# EAGLE schematic main_board (EAGLE 5.01)
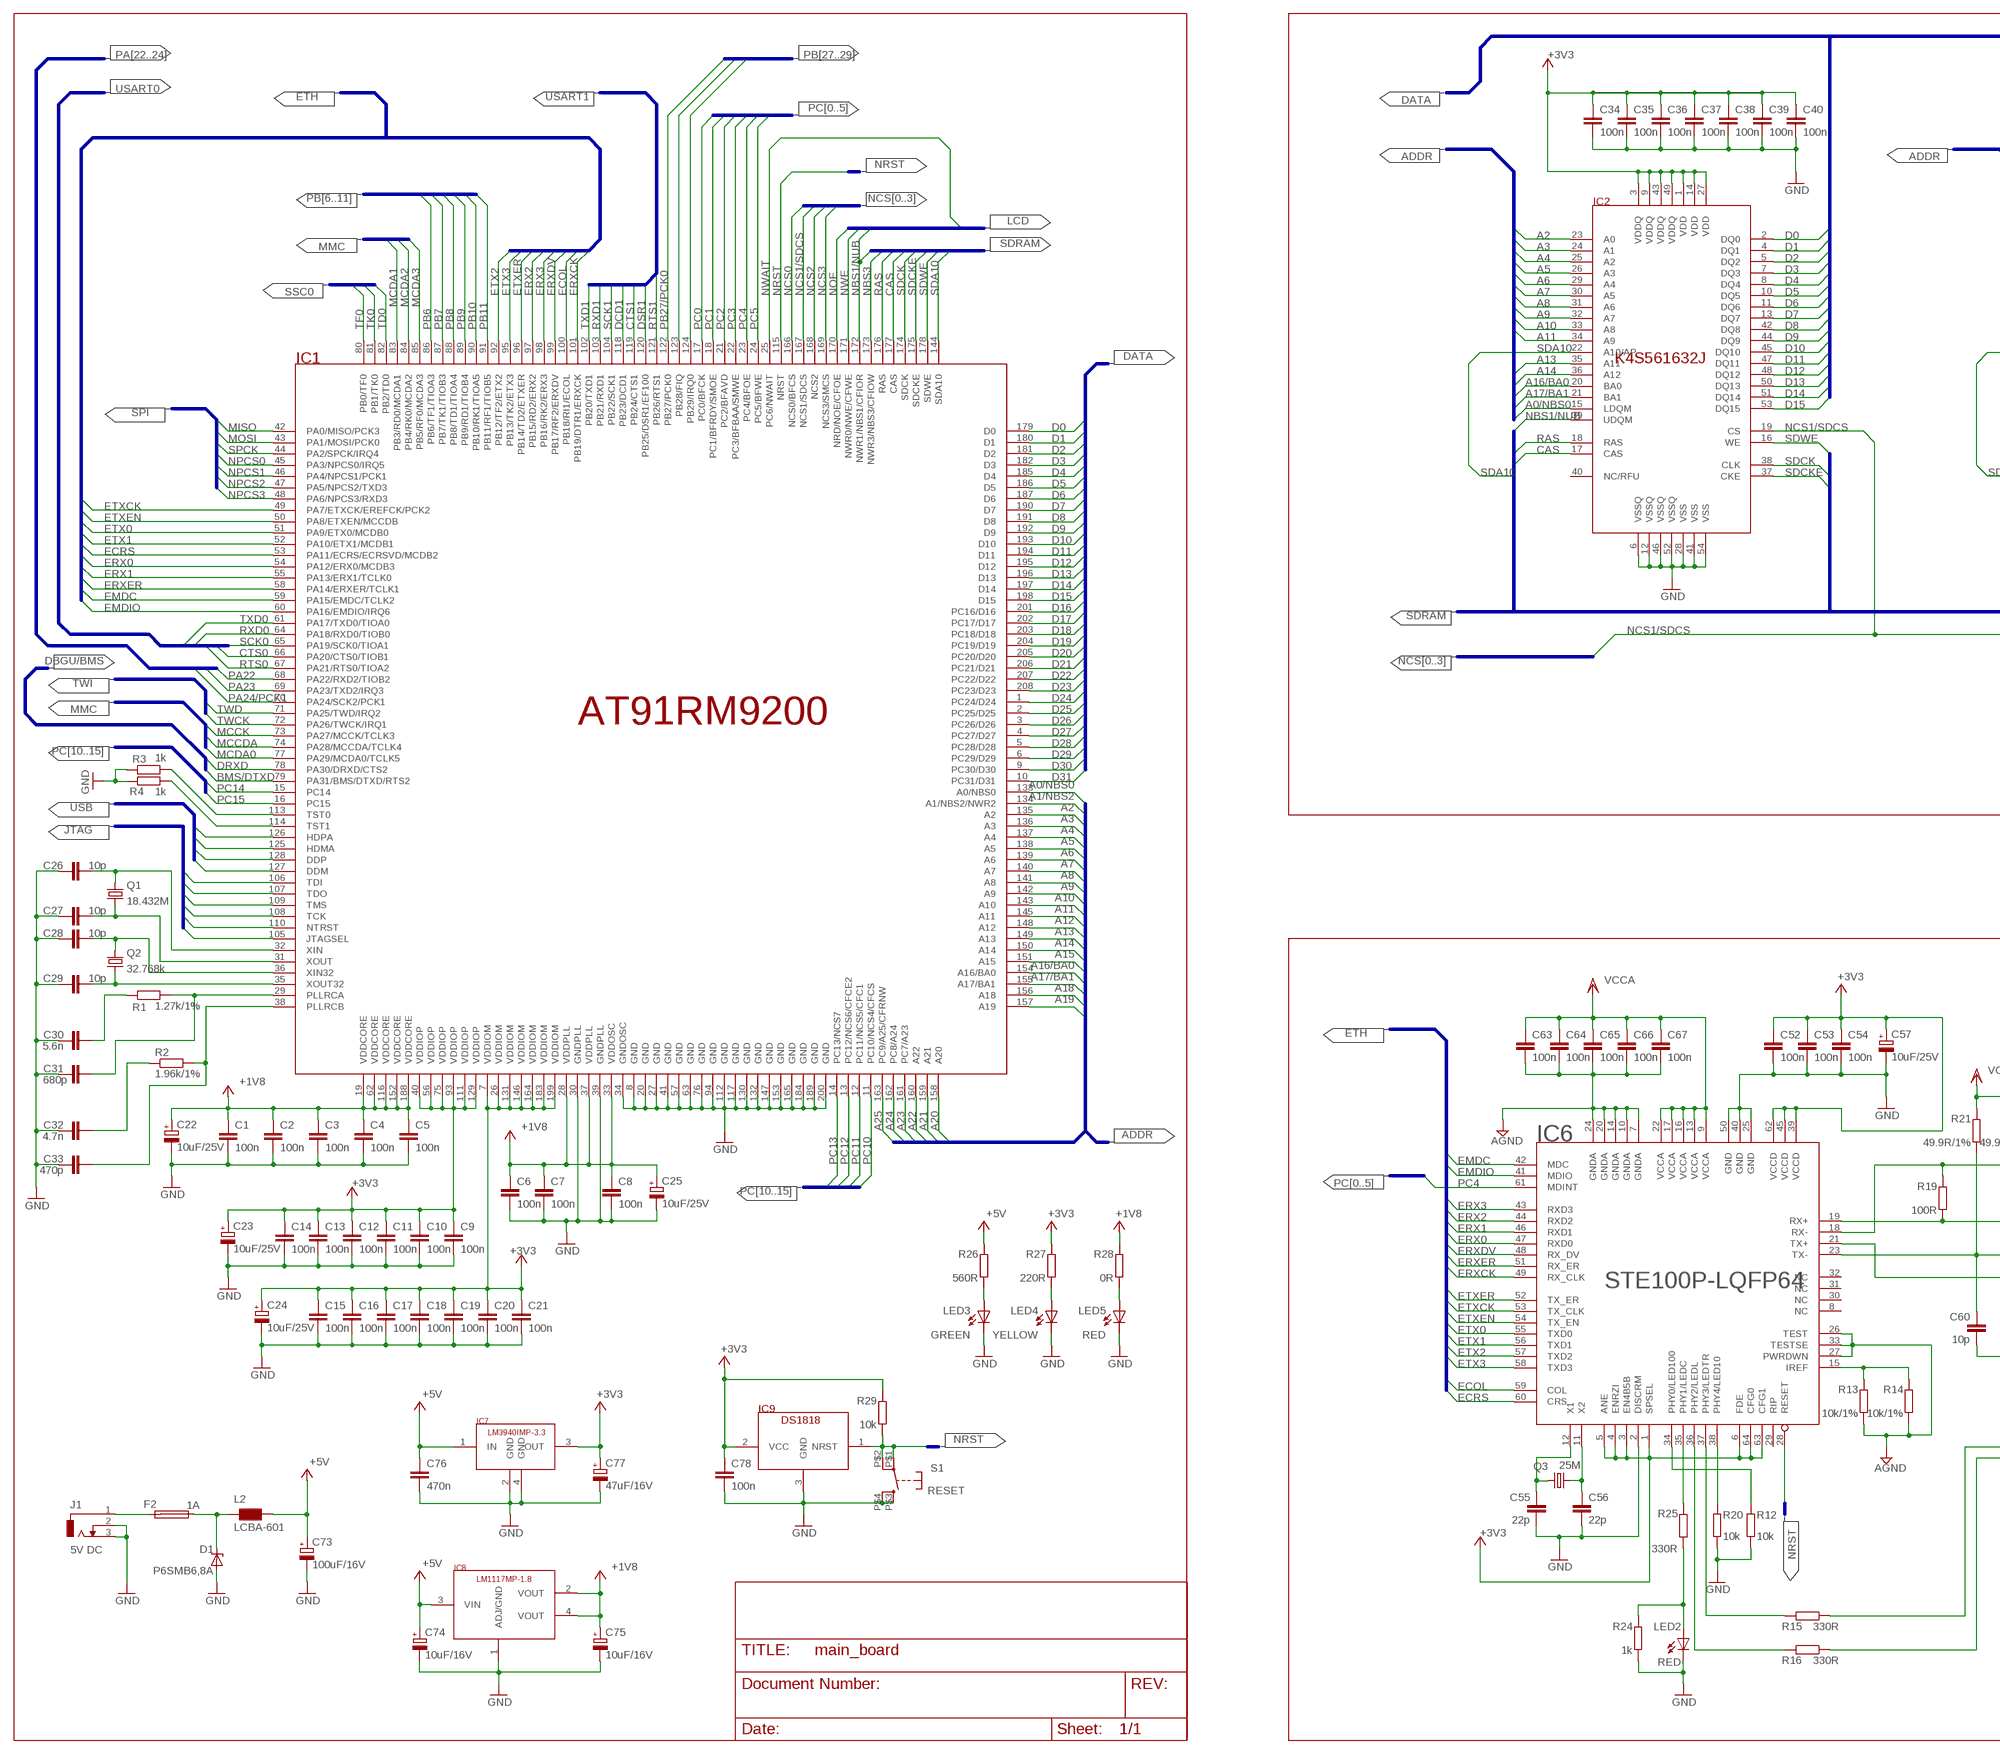
[diagram p0: schematic, sheet 1, part 1 of 2]
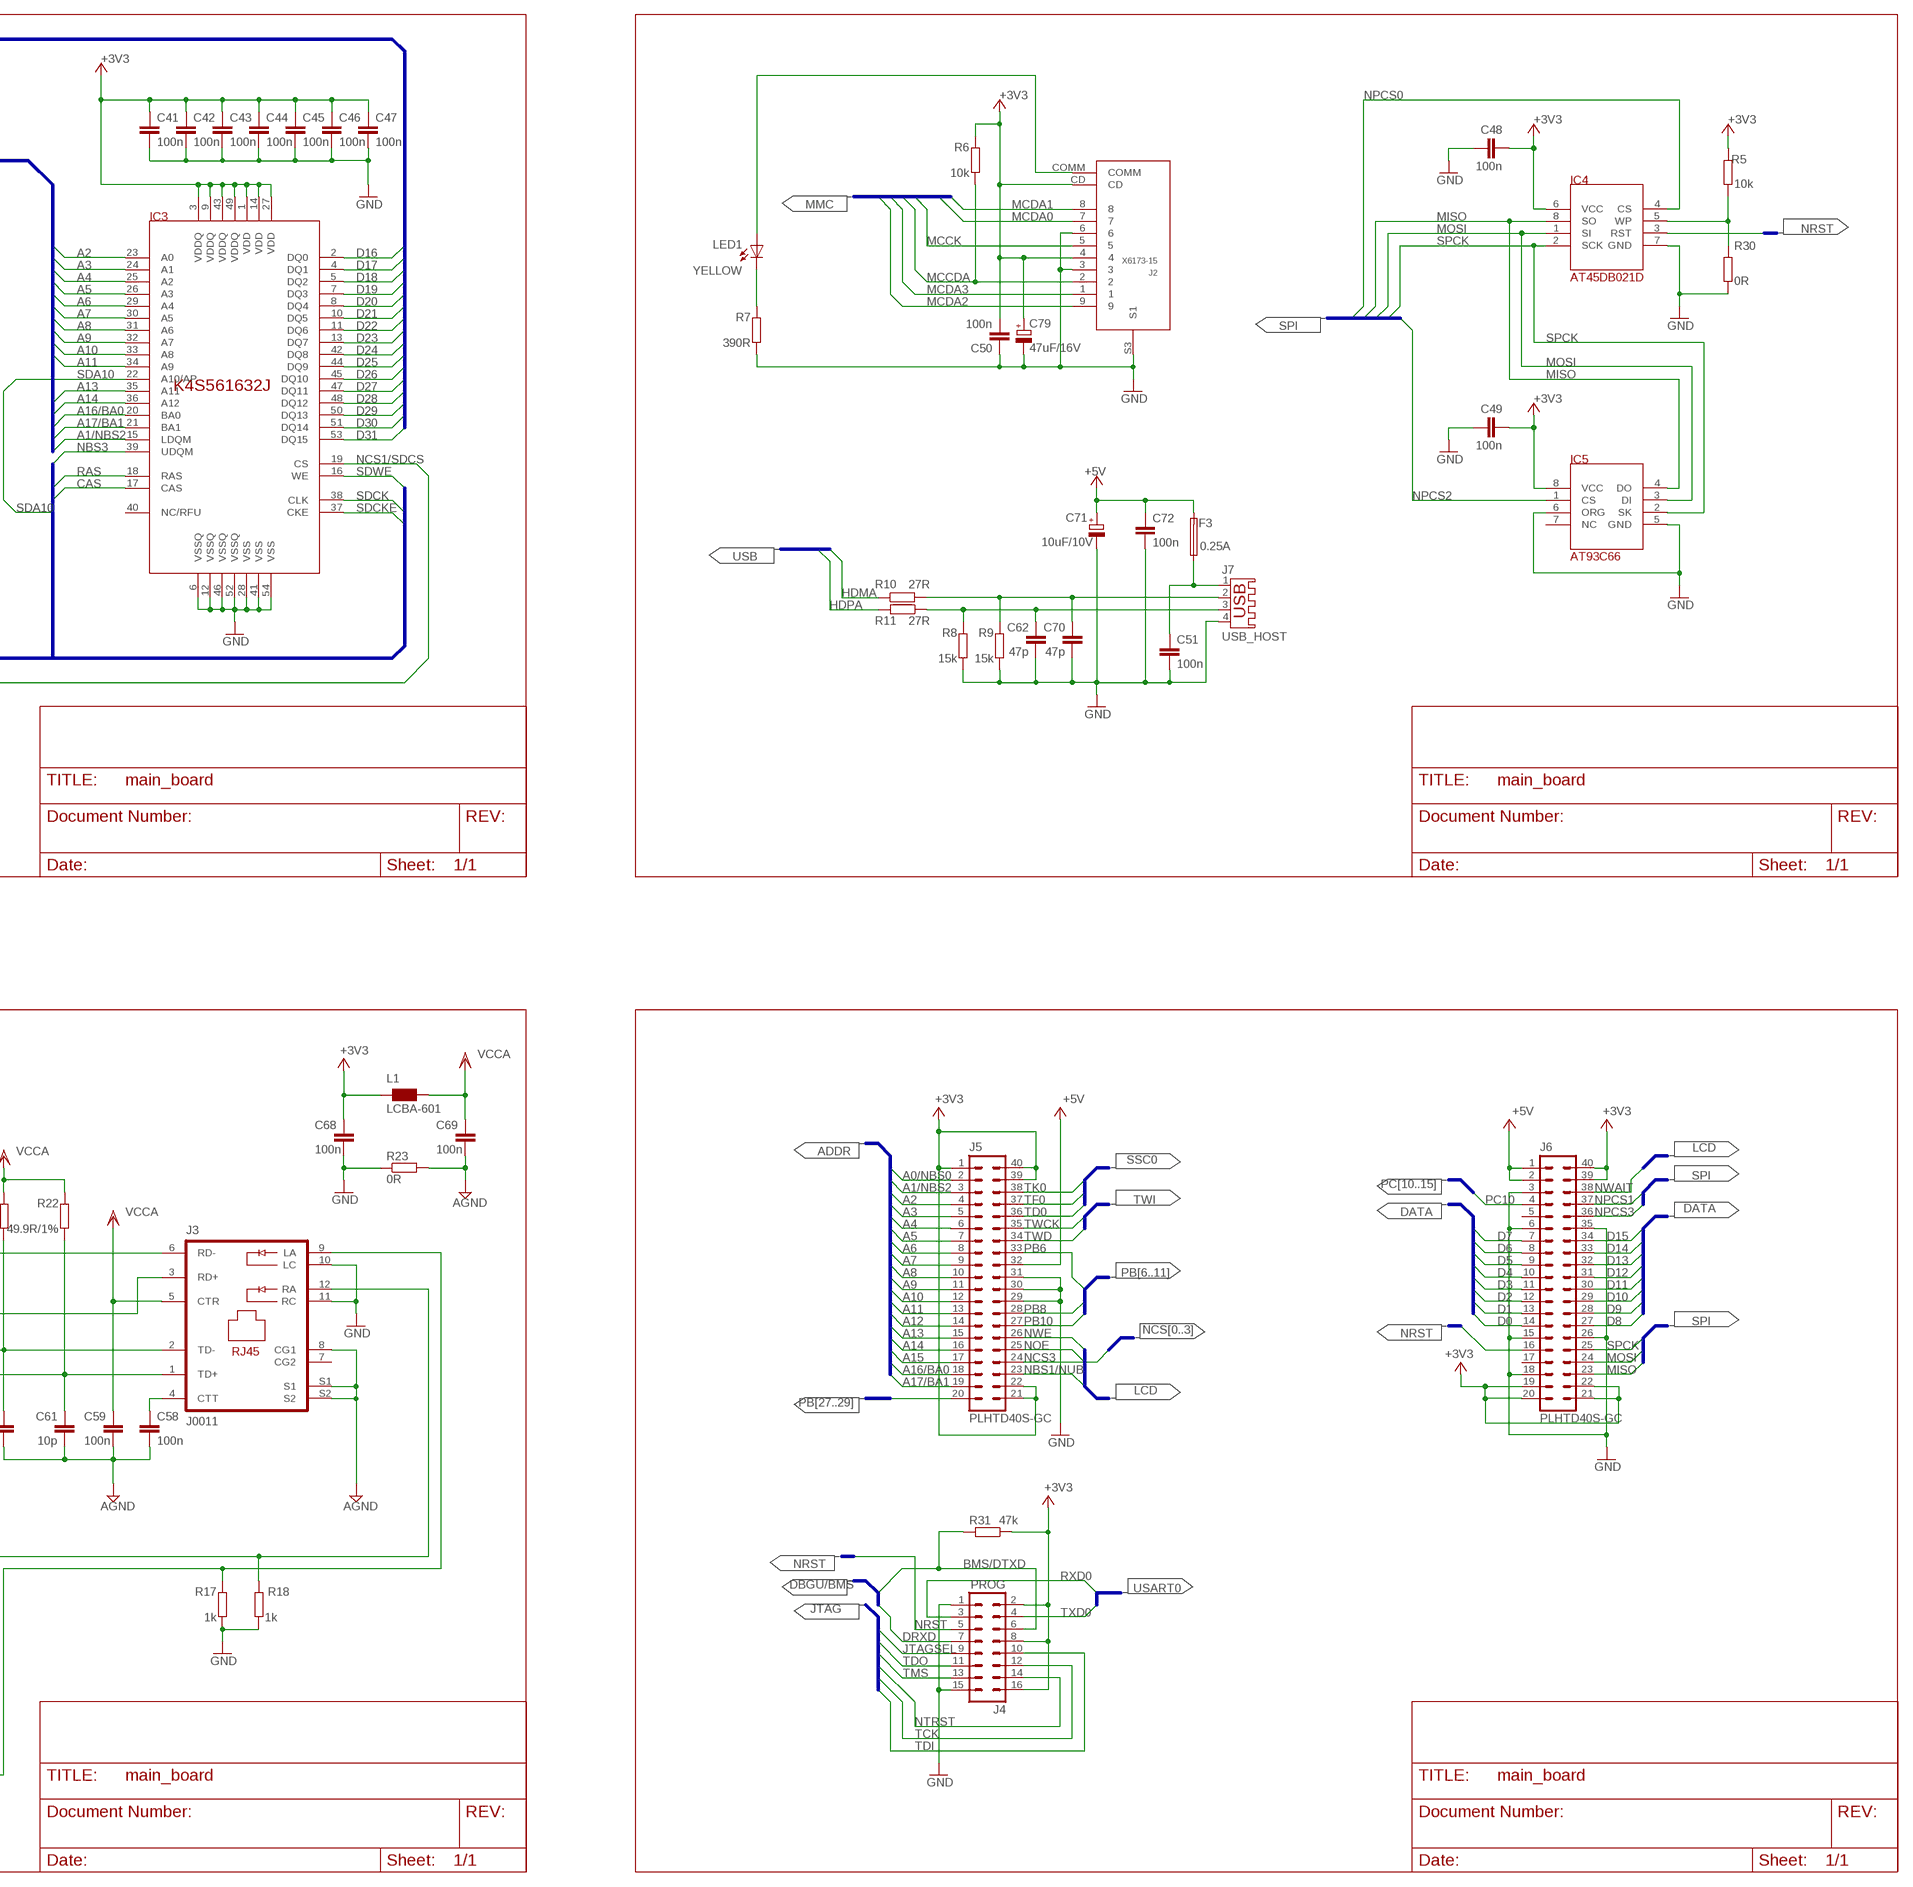
[diagram p1: schematic, sheet 1, part 2 of 2]

## Parts
C1  100n  C-EUC0603K  [C0603K]
C2  100n  C-EUC0603K  [C0603K]
C3  100n  C-EUC0603K  [C0603K]
C4  100n  C-EUC0603K  [C0603K]
C5  100n  C-EUC0603K  [C0603K]
C6  100n  C-EUC0603K  [C0603K]
C7  100n  C-EUC0603K  [C0603K]
C8  100n  C-EUC0603K  [C0603K]
C9  100n  C-EUC0603K  [C0603K]
C10  100n  C-EUC0603K  [C0603K]
C11  100n  C-EUC0603K  [C0603K]
C12  100n  C-EUC0603K  [C0603K]
C13  100n  C-EUC0603K  [C0603K]
C14  100n  C-EUC0603K  [C0603K]
C15  100n  C-EUC0603K  [C0603K]
C16  100n  C-EUC0603K  [C0603K]
C17  100n  C-EUC0603K  [C0603K]
C18  100n  C-EUC0603K  [C0603K]
C19  100n  C-EUC0603K  [C0603K]
C20  100n  C-EUC0603K  [C0603K]
C21  100n  C-EUC0603K  [C0603K]
C22  10uF/25V  CPOL-EU153CLV-0405  [153CLV-0405]
C23  10uF/25V  CPOL-EU153CLV-0405  [153CLV-0405]
C24  10uF/25V  CPOL-EU153CLV-0405  [153CLV-0405]
C25  10uF/25V  CPOL-EU153CLV-0405  [153CLV-0405]
C26  10p  C-EUC0805K  [C0805K]
C27  10p  C-EUC0805K  [C0805K]
C28  10p  C-EUC0805K  [C0805K]
C29  10p  C-EUC0805K  [C0805K]
C30  5.6n  C-EUC0805K  [C0805K]
C31  680p  C-EUC0805K  [C0805K]
C32  4.7n  C-EUC0805K  [C0805K]
C33  470p  C-EUC0805K  [C0805K]
C34  100n  C-EUC0603K  [C0603K]
C35  100n  C-EUC0603K  [C0603K]
C36  100n  C-EUC0603K  [C0603K]
C37  100n  C-EUC0603K  [C0603K]
C38  100n  C-EUC0603K  [C0603K]
C39  100n  C-EUC0603K  [C0603K]
C40  100n  C-EUC0603K  [C0603K]
C41  100n  C-EUC0603K  [C0603K]
C42  100n  C-EUC0603K  [C0603K]
C43  100n  C-EUC0603K  [C0603K]
C44  100n  C-EUC0603K  [C0603K]
C45  100n  C-EUC0603K  [C0603K]
C46  100n  C-EUC0603K  [C0603K]
C47  100n  C-EUC0603K  [C0603K]
C48  100n  C-EUC0603K  [C0603K]
C49  100n  C-EUC0603K  [C0603K]
C50  100n  C-EUC0603K  [C0603K]
C51  100n  C-EUC0603K  [C0603K]
C52  100n  C-EUC0603K  [C0603K]
C53  100n  C-EUC0603K  [C0603K]
C54  100n  C-EUC0603K  [C0603K]
C55  22p  C-EUC0805K  [C0805K]
C56  22p  C-EUC0805K  [C0805K]
C57  10uF/25V  CPOL-EU153CLV-0405  [153CLV-0405]
C58  100n  C-EUC0603K  [C0603K]
C59  100n  C-EUC0603K  [C0603K]
C60  10p  C-EUC0805K  [C0805K]
C61  10p  C-EUC0805K  [C0805K]
C62  47p  C-EUC0805K  [C0805K]
C63  100n  C-EUC0603K  [C0603K]
C64  100n  C-EUC0603K  [C0603K]
C65  100n  C-EUC0603K  [C0603K]
C66  100n  C-EUC0603K  [C0603K]
C67  100n  C-EUC0603K  [C0603K]
C68  100n  C-EUC0603K  [C0603K]
C69  100n  C-EUC0603K  [C0603K]
C70  47p  C-EUC0805K  [C0805K]
C71  10uF/10V  CPOL-EU153CLV-0405  [153CLV-0405]
C72  100n  C-EUC0603K  [C0603K]
C73  100uF/16V  CPOL-EUCT7343  [CT7343]
C74  10uF/16V  CPOL-EUB/3528-21W  [B/3528-21W]
C75  10uF/16V  CPOL-EUB/3528-21W  [B/3528-21W]
C76  470n  C-EUC0805K  [C0805K]
C77  47uF/16V  CPOL-EU153CLV-0605  [153CLV-0605]
C78  100n  C-EUC0603K  [C0603K]
C79  47uF/16V  CPOL-EU153CLV-0605  [153CLV-0605]
D1  P6SMB6,8A  ZENER-DIODESMB  [SMB]
F2  1A  FUSE  [R1206]
F3  0.25A  FUSE  [R1206]
IC1  AT91RM9200  [PQFP208]
IC2  K4S561632J  [TSOP54]
IC3  K4S561632J  [TSOP54]
IC4  AT45DB021D  [SOIC8]
IC5  AT93C66  [SOIC8]
IC6  STE100P-LQFP64  [LQFP64]
IC7  LM3940IMP-3.3  [SOT223]
IC8  LM1117MP-1.8  [SOT223]
IC9  DS1818  [SOT23]
J1  5V DC  DCJ0303  [DCJ0303]
J2  X6173-15  [SDCARD]
J3  J0011  [PJ-J0]
J4  PROG  ML16L  [ML16L]
J5  PLHTD40S-GC  [PLHTD40S-GC]
J6  PLHTD40S-GC  [PLHTD40S-GC]
J7  USB_HOST  USB-A003  [USB-A003]
L1  LCBA-601  WE-CBF_0603  [0603]
L2  LCBA-601  WE-CBF_0603  [0603]
LED1  YELLOW  LEDCHIP-LED0805  [CHIP-LED0805]
LED2  RED  LEDCHIP-LED0805  [CHIP-LED0805]
LED3  GREEN  LEDCHIP-LED0805  [CHIP-LED0805]
LED4  YELLOW  LEDCHIP-LED0805  [CHIP-LED0805]
LED5  RED  LEDCHIP-LED0805  [CHIP-LED0805]
Q1  18.432M  CRYSTALSM49  [SM49]
Q2  32.768k  CRYSTALSM49  [SM49]
Q3  25M  CRYSTALSM49  [SM49]
R1  1.27k/1%  R-EU_R1206  [R1206]
R2  1.96k/1%  R-EU_R1206  [R1206]
R3  1k  R-EU_R0805  [R0805]
R4  1k  R-EU_R0805  [R0805]
R5  10k  R-EU_R0603  [R0603]
R6  10k  R-EU_R0603  [R0603]
R7  390R  R-EU_R0805  [R0805]
R8  15k  R-EU_R0805  [R0805]
R9  15k  R-EU_R0805  [R0805]
R10  27R  R-EU_R0805  [R0805]
R11  27R  R-EU_R0805  [R0805]
R12  10k  R-EU_R0603  [R0603]
R13  10k/1%  R-EU_R0805  [R0805]
R14  10k/1%  R-EU_R0805  [R0805]
R15  330R  R-EU_R0805  [R0805]
R16  330R  R-EU_R0805  [R0805]
R17  1k  R-EU_R0805  [R0805]
R18  1k  R-EU_R0805  [R0805]
R19  100R  R-EU_R0805  [R0805]
R20  10k  R-EU_R0603  [R0603]
R21  49.9R/1%  R-EU_R0805  [R0805]
R22  49.9R/1%  R-EU_R0805  [R0805]
R23  0R  R-EU_R0603  [R0603]
R24  1k  R-EU_R0805  [R0805]
R25  330R  R-EU_R0805  [R0805]
R26  560R  R-EU_R0805  [R0805]
R27  220R  R-EU_R0805  [R0805]
R28  0R  R-EU_R0805  [R0805]
R29  10k  R-EU_R0603  [R0603]
R30  0R  R-EU_R0603  [R0603]
R31  47k  R-EU_R0805  [R0805]
S1  RESET  DTSM-62N  [DTSM-62N]

## Nets
+1V8: C1.1 C2.1 C3.1 C4.1 C5.1 C6.1 C7.1 C8.1 C22.+ C25.+ C75.+ IC1.19(VDDCORE) IC1.28(VDDPLL) IC1.33(VDDOSC) IC1.37(VDDPLL) IC1.62(VDDCORE) IC1.116(VDDCORE) IC1.152(VDDCORE) IC1.188(VDDCORE) IC8.2(VOUT) IC8.4(VOUT) R28.2
+3V3: C9.1 C10.1 C11.1 C12.1 C13.1 C14.1 C15.1 C16.1 C17.1 C18.1 C19.1 C20.1 C21.1 C23.+ C24.+ C34.1 C35.1 C36.1 C37.1 C38.1 C39.1 C40.1 C41.1 C42.1 C43.1 C44.1 C45.1 C46.1 C47.1 C48.2 C49.2 C50.2 C52.1 C53.1 C54.1 C57.+ C68.1 C77.+ C78.1 C79.+ IC1.7(VDDIOM) IC1.26(VDDIOM) IC1.40(VDDIOP) IC1.56(VDDIOP) IC1.75(VDDIOP) IC1.93(VDDIOP) IC1.111(VDDIOP) IC1.129(VDDIOP) IC1.131(VDDIOM) IC1.146(VDDIOM) IC1.164(VDDIOM) IC1.183(VDDIOM) IC1.199(VDDIOM) IC2.1(VDD) IC2.3(VDDQ) IC2.9(VDDQ) IC2.14(VDD) IC2.27(VDD) IC2.43(VDDQ) IC2.49(VDDQ) IC3.1(VDD) IC3.3(VDDQ) IC3.9(VDDQ) IC3.14(VDD) IC3.27(VDD) IC3.43(VDDQ) IC3.49(VDDQ) IC4.6(VCC) IC5.8(VCC) IC6.1(SPSEL) IC6.3(EN4B5B) IC6.4(ENRZI) IC6.5(ANE) IC6.6(FDE) IC6.39(VCCD) IC6.45(VCCD) IC6.62(VCCD) IC6.63(CFG1) IC6.64(CFG0) IC7.3(OUT) IC9.2(VCC) J2.4 J2.CD J4.2 J4.8 J4.16 J5.1 J5.21 J5.22 J5.39 J5.40 J6.19 J6.20 J6.21 J6.22 J6.39 J6.40 L1.1 R5.2 R6.2 R27.2 R29.2 R31.1
+5V: C71.+ C72.1 C73.+ C74.+ C76.2 F3.2 IC7.1(IN) IC8.3(VIN) J5.32 J6.1 J6.2 L2.2 R26.2
A0/NBS0: IC1.133(A0/NBS0) IC2.15(LDQM) J5.2
A1/NBS2: IC1.134(A1/NBS2/NWR2) IC3.15(LDQM) J5.3
A2: IC1.135(A2) IC2.23(A0) IC3.23(A0) J5.4
A3: IC1.136(A3) IC2.24(A1) IC3.24(A1) J5.5
A4: IC1.137(A4) IC2.25(A2) IC3.25(A2) J5.6
A5: IC1.138(A5) IC2.26(A3) IC3.26(A3) J5.7
A6: IC1.139(A6) IC2.29(A4) IC3.29(A4) J5.8
A7: IC1.140(A7) IC2.30(A5) IC3.30(A5) J5.9
A8: IC1.141(A8) IC2.31(A6) IC3.31(A6) J5.10
A9: IC1.142(A9) IC2.32(A7) IC3.32(A7) J5.11
A10: IC1.143(A10) IC2.33(A8) IC3.33(A8) J5.12
A11: IC1.145(A11) IC2.34(A9) IC3.34(A9) J5.13
A12: IC1.148(A12) J5.14
A13: IC1.149(A13) IC2.35(A11) IC3.35(A11) J5.15
A14: IC1.150(A14) IC2.36(A12) IC3.36(A12) J5.16
A15: IC1.151(A15) J5.17
A16/BA0: IC1.154(A16/BA0) IC2.20(BA0) IC3.20(BA0) J5.18
A17/BA1: IC1.155(A17/BA1) IC2.21(BA1) IC3.21(BA1) J5.19
A18: IC1.156(A18)
A19: IC1.157(A19)
A20: IC1.158(A20)
A21: IC1.159(A21)
A22: IC1.160(A22)
A23: IC1.161(PC7/A23)
A24: IC1.162(PC8/A24)
A25: IC1.163(PC9/A25/CFRNW)
AGND: C58.2 C59.2 C60.1 C61.1 C63.2 C64.2 C65.2 C66.2 C67.2 C69.2 IC6.7(GNDA) IC6.10(GNDA) IC6.14(GNDA) IC6.20(GNDA) IC6.24(GNDA) IC6.26(TEST) IC6.27(PWRDWN) IC6.33(TESTSE) J3.8(CG1) J3.S1 J3.S2 R13.1 R14.1 R23.2
BMS/DTXD: IC1.79(PA31/BMS/DTXD/RTS2) J4.6 R31.2
CAS: IC1.177(CAS) IC2.17(CAS) IC3.17(CAS)
CTS0: IC1.66(PA20/CTS0/TIOB1)
CTS1: IC1.119(PB24/CTS1)
D0: IC1.179(D0) IC2.2(DQ0) J6.14
D1: IC1.180(D1) IC2.4(DQ1) J6.13
D2: IC1.181(D2) IC2.5(DQ2) J6.12
D3: IC1.182(D3) IC2.7(DQ3) J6.11
D4: IC1.185(D4) IC2.8(DQ4) J6.10
D5: IC1.186(D5) IC2.10(DQ5) J6.9
D6: IC1.187(D6) IC2.11(DQ6) J6.8
D7: IC1.190(D7) IC2.13(DQ7) J6.7
D8: IC1.191(D8) IC2.42(DQ8) J6.27
D9: IC1.192(D9) IC2.44(DQ9) J6.28
D10: IC1.193(D10) IC2.45(DQ10) J6.29
D11: IC1.194(D11) IC2.47(DQ11) J6.30
D12: IC1.195(D12) IC2.48(DQ12) J6.31
D13: IC1.196(D13) IC2.50(DQ13) J6.32
D14: IC1.197(D14) IC2.51(DQ14) J6.33
D15: IC1.198(D15) IC2.53(DQ15) J6.34
D16: IC1.201(PC16/D16) IC3.2(DQ0)
D17: IC1.202(PC17/D17) IC3.4(DQ1)
D18: IC1.203(PC18/D18) IC3.5(DQ2)
D19: IC1.204(PC19/D19) IC3.7(DQ3)
D20: IC1.205(PC20/D20) IC3.8(DQ4)
D21: IC1.206(PC21/D21) IC3.10(DQ5)
D22: IC1.207(PC22/D22) IC3.11(DQ6)
D23: IC1.208(PC23/D23) IC3.13(DQ7)
D24: IC1.1(PC24/D24) IC3.42(DQ8)
D25: IC1.2(PC25/D25) IC3.44(DQ9)
D26: IC1.3(PC26/D26) IC3.45(DQ10)
D27: IC1.4(PC27/D27) IC3.47(DQ11)
D28: IC1.5(PC28/D28) IC3.48(DQ12)
D29: IC1.6(PC29/D29) IC3.50(DQ13)
D30: IC1.9(PC30/D30) IC3.51(DQ14)
D31: IC1.10(PC31/D31) IC3.53(DQ15)
DCD1: IC1.118(PB23/DCD1)
DDM: IC1.127(DDM)
DDP: IC1.128(DDP)
DRXD: IC1.78(PA30/DRXD/CTS2) J4.7
DSR1: IC1.120(PB25/DSR1/EF100)
ECOL: IC1.100(PB18/RI1/ECOL) IC6.59(COL)
ECRS: IC1.53(PA11/ECRS/ECRSVD/MCDB2) IC6.60(CRS)
EMDC: IC1.59(PA15/EMDC/TCLK2) IC6.42(MDC)
EMDIO: IC1.60(PA16/EMDIO/IRQ6) IC6.41(MDIO)
ERX0: IC1.54(PA12/ERX0/MCDB3) IC6.47(RXD0)
ERX1: IC1.55(PA13/ERX1/TCLK0) IC6.46(RXD1)
ERX2: IC1.97(PB15/RD2/ERX2) IC6.44(RXD2)
ERX3: IC1.98(PB16/RK2/ERX3) IC6.43(RXD3)
ERXCK: IC1.101(PB19/DTR1/ERXCK) IC6.49(RX_CLK)
ERXDV: IC1.99(PB17/RF2/ERXDV) IC6.48(RX_DV)
ERXER: IC1.58(PA14/ERXER/TCLK1) IC6.51(RX_ER)
ETX0: IC1.51(PA9/ETX0/MCDB0) IC6.55(TXD0)
ETX1: IC1.52(PA10/ETX1/MCDB1) IC6.56(TXD1)
ETX2: IC1.92(PB12/TF2/ETX2) IC6.57(TXD2)
ETX3: IC1.95(PB13/TK2/ETX3) IC6.58(TXD3)
ETXCK: IC1.49(PA7/ETXCK/EREFCK/PCK2) IC6.53(TX_CLK)
ETXEN: IC1.50(PA8/ETXEN/MCCDB) IC6.54(TX_EN)
ETXER: IC1.96(PB14/TD2/ETXER) IC6.52(TX_ER)
GND: C1.2 C2.2 C3.2 C4.2 C5.2 C6.2 C7.2 C8.2 C9.2 C10.2 C11.2 C12.2 C13.2 C14.2 C15.2 C16.2 C17.2 C18.2 C19.2 C20.2 C21.2 C22.- C23.- C24.- C25.- C26.1 C27.1 C28.1 C29.1 C30.1 C31.1 C32.1 C33.1 C34.2 C35.2 C36.2 C37.2 C38.2 C39.2 C40.2 C41.2 C42.2 C43.2 C44.2 C45.2 C46.2 C47.2 C48.1 C49.1 C50.1 C51.2 C52.2 C53.2 C54.2 C55.1 C56.1 C57.- C62.2 C68.2 C70.2 C71.- C72.2 C73.- C74.- C75.- C76.1 C77.- C78.2 C79.- D1.A IC1.8(GND) IC1.20(GND) IC1.27(GND) IC1.30(GNDPLL) IC1.34(GNDOSC) IC1.39(GNDPLL) IC1.41(GND) IC1.57(GND) IC1.63(GND) IC1.76(GND) IC1.94(GND) IC1.112(GND) IC1.117(GND) IC1.130(GND) IC1.132(GND) IC1.147(GND) IC1.153(GND) IC1.165(GND) IC1.184(GND) IC1.189(GND) IC1.200(GND) IC2.6(VSSQ) IC2.12(VSSQ) IC2.28(VSS) IC2.41(VSS) IC2.46(VSSQ) IC2.52(VSSQ) IC2.54(VSS) IC3.6(VSSQ) IC3.12(VSSQ) IC3.28(VSS) IC3.41(VSS) IC3.46(VSSQ) IC3.52(VSSQ) IC3.54(VSS) IC4.7(GND) IC5.5(GND) IC5.6(ORG) IC6.2(DISCRM) IC6.25(GND) IC6.40(GND) IC6.50(GND) IC7.2(GND) IC7.4(GND) IC8.1(ADJ/GND) IC9.3(GND) J1.2 J1.3 J2.3 J2.6 J2.S3(S1) J3.10(LC) J3.11(RC) J4.1 J4.15 J5.29 J5.30 J5.31 J6.3 J6.6 J6.15 J6.18 J6.26 J6.35 J7.4 LED2.C LED3.C LED4.C LED5.C R3.1 R4.1 R7.1 R8.1 R9.1 R12.1 R17.1 R18.1 R20.1 R23.1 R24.1 R30.1 S1.P$3(S) S1.P$4(S)
HDMA: IC1.125(HDMA) R10.1
HDPA: IC1.126(HDPA) R11.2
JTAGSEL: IC1.105(JTAGSEL) J4.9
MCCDA: IC1.74(PA28/MCCDA/TCLK4) J2.2 R6.1
MCCK: IC1.73(PA27/MCCK/TCLK3) J2.5
MCDA0: IC1.77(PA29/MCDA0/TCLK5) J2.7
MCDA1: IC1.83(PB3/RD0/MCDA1) J2.8
MCDA2: IC1.84(PB4/RK0/MCDA2) J2.9
MCDA3: IC1.85(PB5/RF0/MCDA3) J2.1
MISO: IC1.42(PA0/MISO/PCK3) IC4.8(SO) IC5.4(DO) J6.23
MOSI: IC1.43(PA1/MOSI/PCK0) IC4.1(SI) IC5.3(DI) J6.24
N$1: C26.2 IC1.32(XIN) Q1.2
N$2: C27.2 IC1.31(XOUT) Q1.1
N$3: C28.2 IC1.36(XIN32) Q2.2
N$4: C29.2 IC1.35(XOUT32) Q2.1
N$5: IC1.114(TST1) R4.2
N$6: C31.2 IC1.29(PLLRCA) R1.2
N$7: C30.2 R1.1
N$8: C33.2 IC1.38(PLLRCB) R2.2
N$9: C32.2 R2.1
N$10: IC1.113(TST0) R3.2
N$11: IC4.5(WP) R5.1 R30.2
N$12: C56.2 IC6.11(X2) Q3.1
N$13: IC6.15(IREF) R13.2 R14.2
N$14: J2.COMM LED1.A
N$15: LED1.C R7.2
N$16: C62.1 J7.3 R8.2 R11.1
N$17: C70.1 J7.2 R9.2 R10.2
N$18: C51.1 F3.1 J7.1
N$19: IC6.34(PHY0/LED100) R12.2
N$20: C55.2 IC6.12(X1) Q3.2
N$21: IC6.37(PHY3/LEDTR) R15.2
N$22: IC6.36(PHY2/LEDL) R16.2
N$23: C58.1 J3.4(CTT)
N$24: J3.12(RA) R15.1 R18.2
N$25: J3.9(LA) R16.1 R17.2
N$26: IC6.19(RX+) J3.3(RD+) R19.1
N$28: C61.2 IC6.21(TX+) J3.1(TD+) R22.1
N$29: C60.2 IC6.23(TX-) J3.2(TD-) R21.1
N$32: IC6.18(RX-) J3.6(RD-) R19.2
N$33: IC6.35(PHY1/LEDC) R25.1
N$35: LED3.A R26.1
N$36: LED5.A R28.1
N$37: LED4.A R27.1
N$45: LED2.A R24.2 R25.2
N$49: F2.2 J1.1
N$61: D1.C F2.1 L2.1
N$66: IC6.38(PHY4/LED10) R20.2
NBS1/NUB: IC1.172(NWR1/NBS1/CFIOR) IC2.39(UDQM) J5.23
NBS3: IC1.173(NWR3/NBS3/CFIOW) IC3.39(UDQM)
NCS0: IC1.166(NCS0/BFCS)
NCS1/SDCS: IC1.167(NCS1/SDCS) IC2.19(CS) IC3.19(CS)
NCS2: IC1.168(NCS2)
NCS3: IC1.169(NCS3/SMCS) J5.24
NOE: IC1.170(NRD/NOE/CFOE) J5.25
NPCS0: IC1.45(PA3/NPCS0/IRQ5) IC4.4(CS)
NPCS1: IC1.46(PA4/NPCS1/PCK1) J6.37
NPCS2: IC1.47(PA5/NPCS2/TXD3) IC5.1(CS)
NPCS3: IC1.48(PA6/NPCS3/RXD3) J6.36
NRST: IC1.115(NRST) IC4.3(RST) IC6.28(RESET) IC9.1(NRST) J4.5 J6.16 R29.1 S1.P$1(P) S1.P$2(P)
NTRST: IC1.110(NTRST) J4.14
NWAIT: IC1.25(PC6/NWAIT) J6.38
NWE: IC1.171(NWR0/NWE/CFWE) J5.26
PA22: IC1.68(PA22/RXD2/TIOB2)
PA23: IC1.69(PA23/TXD2/IRQ3)
PA24/PCK1: IC1.70(PA24/SCK2/PCK1)
PB6: IC1.86(PB6/TF1/TIOA3) J5.33
PB7: IC1.87(PB7/TK1/TIOB3)
PB8: IC1.88(PB8/TD1/TIOA4) J5.28
PB9: IC1.89(PB9/RD1/TIOB4)
PB10: IC1.90(PB10/RK1/TIOA5) J5.27
PB11: IC1.91(PB11/RF1/TIOB5)
PB27/PCK0: IC1.122(PB27/PCK0) J5.20
PB28: IC1.123(PB28/FIQ)
PB29: IC1.124(PB29/IRQ0)
PC0: IC1.17(PC0/BFCK)
PC1: IC1.18(PC1/BFRDY/SMOE)
PC2: IC1.21(PC2/BFAVD)
PC3: IC1.22(PC3/BFBAA/SMWE)
PC4: IC1.23(PC4/BFOE) IC6.61(MDINT)
PC5: IC1.24(PC5/BFWE)
PC10: IC1.11(PC10/NCS4/CFCS) J6.4
PC11: IC1.12(PC11/NCS5/CFC1)
PC12: IC1.13(PC12/NCS6/CFCE2)
PC13: IC1.14(PC13/NCS7)
PC14: IC1.15(PC14)
PC15: IC1.16(PC15)
RAS: IC1.176(RAS) IC2.18(RAS) IC3.18(RAS)
RTS0: IC1.67(PA21/RTS0/TIOA2)
RTS1: IC1.121(PB26/RTS1)
RXD0: IC1.64(PA18/RXD0/TIOB0) J4.3
RXD1: IC1.103(PB21/RXD1)
SCK0: IC1.65(PA19/SCK0/TIOA1)
SCK1: IC1.104(PB22/SCK1)
SDA10: IC1.144(SDA10) IC2.22(A10/AP) IC3.22(A10/AP)
SDCK: IC1.174(SDCK) IC2.38(CLK) IC3.38(CLK)
SDCKE: IC1.175(SDCKE) IC2.37(CKE) IC3.37(CKE)
SDWE: IC1.178(SDWE) IC2.16(WE) IC3.16(WE)
SPCK: IC1.44(PA2/SPCK/IRQ4) IC4.2(SCK) IC5.2(SK) J6.25
TCK: IC1.108(TCK) J4.12
TD0: IC1.82(PB2/TD0) J5.36
TDI: IC1.106(TDI) J4.10
TDO: IC1.107(TDO) J4.11
TF0: IC1.80(PB0/TF0) J5.37
TK0: IC1.81(PB1/TK0) J5.38
TMS: IC1.109(TMS) J4.13
TWCK: IC1.72(PA26/TWCK/IRQ1) J5.35
TWD: IC1.71(PA25/TWD/IRQ2) J5.34
TXD0: IC1.61(PA17/TXD0/TIOA0) J4.4
TXD1: IC1.102(PB20/TXD1)
VCCA: C59.1 C63.1 C64.1 C65.1 C66.1 C67.1 C69.1 IC6.9(VCCA) IC6.13(VCCA) IC6.16(VCCA) IC6.17(VCCA) IC6.22(VCCA) J3.5(CTR) L1.2 R21.2 R22.2
Unconnected: IC2.40(NC/RFU) IC3.40(NC/RFU) IC5.7(NC) IC6.8(NC) IC6.29(RIP) IC6.30(NC) IC6.31(NC) IC6.32(NC) J3.7(CG2) J6.5 J6.17

## Buses
TDI,TDO,TMS,TCK,NTRST,JTAGSEL
HDPA,HDMA,DDP,DDM
D[0..31]
ETXEN,ETXCK,ETX[0..3],ETXER,ERXDV,ERXCK,ERX[0..3],ERXER,ECOL,ECRS,EMDIO,EMDC
TWD,TWCK
MCCK,MCCDA,MCDA[0..3]
MISO,MOSI,SPCK,NPCS[0..3]
A0/NBS0,A1/NBS2,A[2..15],A16/BA0,A17/BA1,A[18..25]
PC[10..15]
DRXD,BMS/DTXD
RAS,CAS,SDCK,SDCKE,SDWE,SDA10,NBS1/NUB,NBS3
TF0,TK0,TD0
NWAIT,NOE,NWE,NBS1/NUB
NCS0,NCS1/SDCS,NCS[2..3]
PC[0..5]
PB[6..11]
TXD0,RXD0,SCK0,CTS0,RTS0
PA22,PA23,PA24/PCK1
PB27/PCK0,PB28,PB29
TXD1,RXD1,SCK1,DCD1,CTS1,DSR1,RTS1
NRST

## Notes on the sheet
- PA[22..24] | PB[27..29]
- USART0 | ETH | USART1
- PC[0..5] | DATA
- NRST | ADDR | ADDR
- PB[6..11] | NCS[0..3] | MMC
- LCD | NRST
- SDRAM
- MMC
- SSC0
- SPI
- DATA
- SPI
- USB
- SDRAM
- DBGU/BMS | NCS[0..3]
- TWI
- MMC
- PC[10..15]
- USB
- JTAG
- ETH
- LCD
- ADDR | SSC0
- PC[10..15] | SPI
- TWI | DATA
- ADDR | DATA
- PC[10..15] | PC[0..5] | PB[6..11]
- NCS[0..3] | SPI
- NRST
- LCD
- PB[27..29]
- NRST
- NRST
- DBGU/BMS
- USART0
- JTAG
- NRST

## Library data of the parts
C1-C21 C26-C56 C58-C70 C72 C76 C78 = rcl:C-EU: CAPACITOR, European symbol
C22-C25 C57 C71 C73-C75 C77 C79 = rcl:CPOL-EU: POLARIZED CAPACITOR, European symbol
D1 = diode:ZENER-DIODE: Z-Diode
F2 F3 = mylib:FUSE
IC1 = mylib:AT91RM9200: Atmel's ARM920T-based Microcontroller
IC2 IC3 = mylib:K4S561632J: 256Mb Synchronous DRAM
IC4 = mylib:AT45DB021D: 2Mb Serial Dataflash memory
IC5 = mylib:AT93C66: 4kB Serial EEPROM
IC6 = ste100p:STE100P
IC7 = mylib:LM3940IMP-3.3: 1A Low Dropout Regulator for 5V to 3.3V conversion
IC8 = mylib:LM1117MP-1.8: 0.8A LDO Linear Voltage Regulator
IC9 = mylib:DS1818: 3.3V EconoReset with Pushbutton
J1 = con-jack:DCJ0303: DC POWER JACK Source: DCJ0303.pdf
J2 = sd_mmc_card_connector_custom:X6173-15: SD/MMSC X6173-15 connector from Wielson, author: Grzegorz Rajtar, mcgregor@blackmesaeast.com.pl
J3 = con-pulse:J0011
J4 = con-harting-ml:ML16: HARTING
J5 J6 = mylib:PLHTD40S-GC: 40-pin Goldpin SMT connector
J7 = con-yamaichi:USB-A003: USB connector
L1 L2 = wuerth-elektronik:WE-CBF: SMD EMI Suppression Ferrite Beads - excellent anti-EMI properties - low DCR - impedances till 3000 ohms - rated current up to 6 A
LED1-LED5 = led:LED: LED OSRAM: - CHIPLED LG R971, LG N971, LY N971, LG Q971, LY Q971, LO R971, LY R971 LH N974, LH R974 LS Q976, LO Q976, LY Q976 LO Q996 - Hyper CHIPLED LW Q18S LB Q993, LB Q99A, LB R99A - SideLED LS A670, LO A670, LY A670, LG A670, LP A670 LB A673, LV A673, LT A673, LW A673 LH A674 LY A675 LS A676, LA A676, LO A676, LY A676, LW A676 LS A679, LY A679, LG A679 - Hyper Micro SIDELED® LS Y876, LA Y876, LO Y876, LY Y876 LT Y87S - SmartLED LW L88C, LW L88S LB L89C, LB L89S, LG L890 LS L89K, LO L89K, LY L89K LS L896, LA L896, LO L896, LY L896 - TOPLED LS T670, LO T670, LY T670, LG T670, LP T670 LSG T670, LSP T670, LSY T670, LOP T670, LYG T670 LG T671, LOG T671, LSG T671 LB T673, LV T673, LT T673, LW T673 LH T674 LS T676, LA T676, LO T676, LY T676, LB T676, LH T676, LSB T676, LW T676 LB T67C, LV T67C, LT T67C, LS T67K, LO T67K, LY T67K, LW E67C LS E67B, LA E67B, LO E67B, LY E67B, LB E67C, LV E67C, LT E67C LW T67C LS T679, LY T679, LG T679 LS T770, LO T770, LY T770, LG T770, LP T770 LB T773, LV T773, LT T773, LW T773 LH T774 LS E675, LA E675, LY E675, LS T675 LS T776, LA T776, LO T776, LY T776, LB T776 LHGB T686 LT T68C, LB T68C - Hyper Mini TOPLED® LB M676 - Mini TOPLED Santana® LG M470 LS M47K, LO M47K, LY M47K Source: http://www.osram.convergy.de - LUMILED® LXK2-PW12-R00, LXK2-PW12-S00, LXK2-PW14-U00, LXK2-PW14-V00 LXK2-PM12-R00, LXK2-PM12-S00, LXK2-PM14-U00 LXK2-PE12-Q00, LXK2-PE12-R00, LXK2-PE12-S00, LXK2-PE14-T00, LXK2-PE14-U00 LXK2-PB12-K00, LXK2-PB12-L00, LXK2-PB12-M00, LXK2-PB14-N00, LXK2-PB14-P00, LXK2-PB14-Q00 LXK2-PR12-L00, LXK2-PR12-M00, LXK2-PR14-Q00, LXK2-PR14-R00 LXK2-PD12-Q00, LXK2-PD12-R00, LXK2-PD12-S00 LXK2-PH12-R00, LXK2-PH12-S00 LXK2-PL12-P00, LXK2-PL12-Q00, LXK2-PL12-R00 Source: www.luxeon.com
Q1-Q3 = crystal:CRYSTAL: CRYSTAL
R1-R31 = rcl:R-EU_: RESISTOR, European symbol
S1 = mylib:DTSM-62N: 6x6 SMD Tact Switch